# EAGLE schematic Scale_Car_Board_20260624 (EAGLE 9.7.0)
CLIENT: FUTURE MOBILITY LAB; DOCNUM: SC001; REV: 0.0

## Sheet 1 of 4
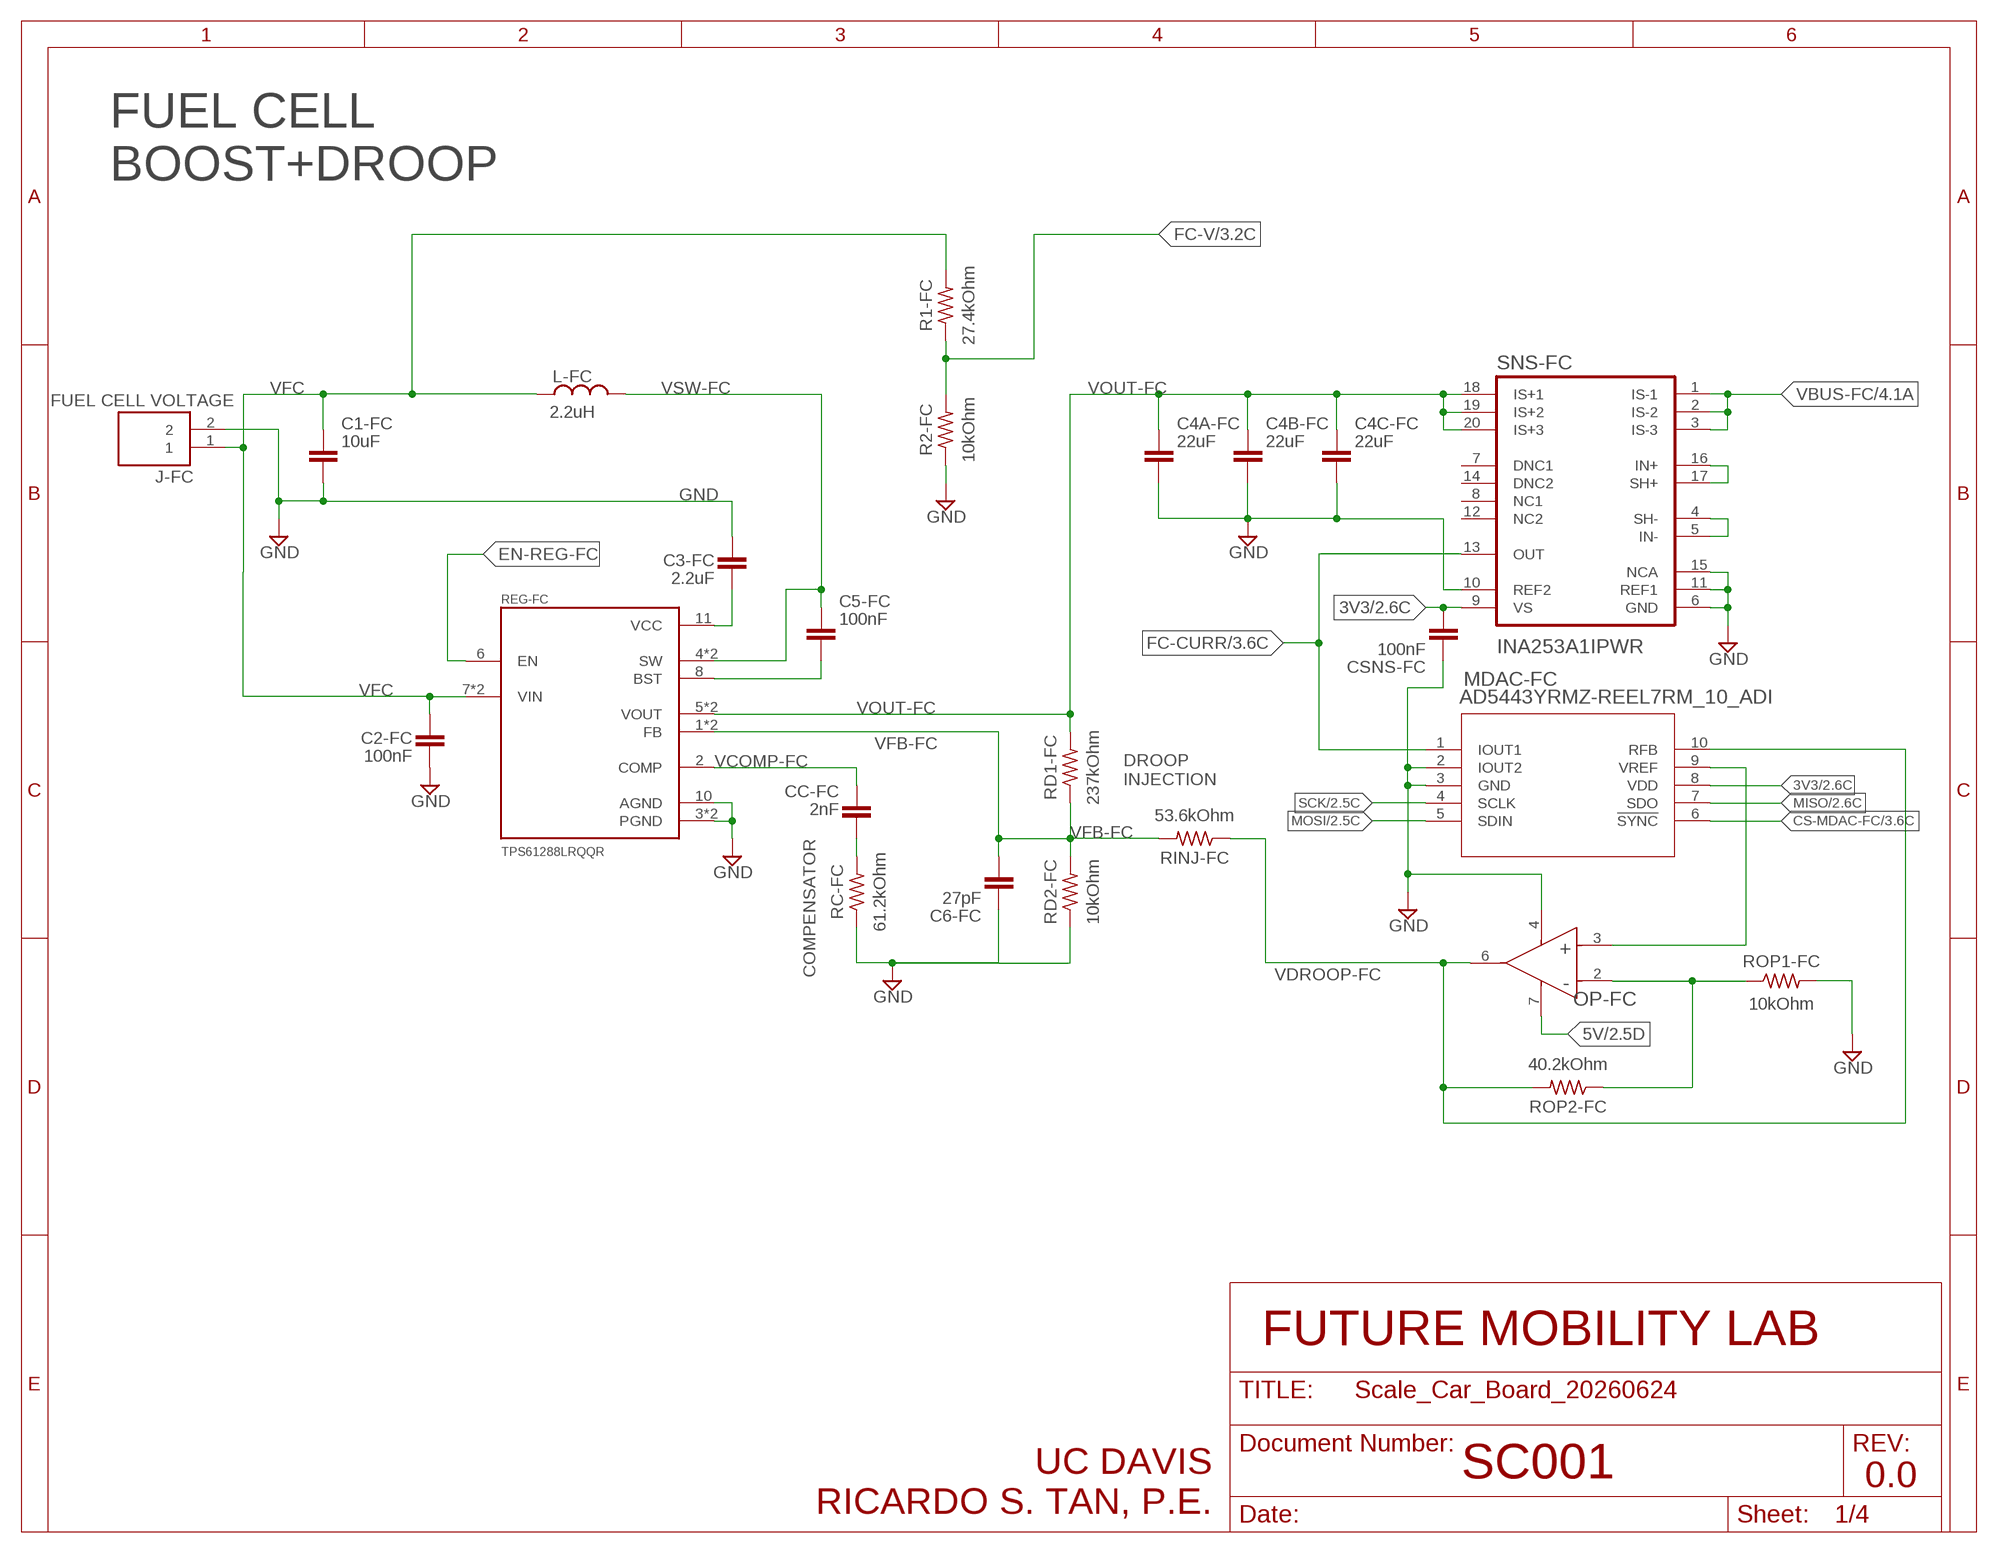
[diagram p0: schematic, sheet 1]

### Parts
C1-FC  10uF  C_CHIP-0805(2012-METRIC)  [CAPC2012X110]
C2-FC  100nF  C_CHIP-0603(1608-METRIC)  [CAPC1608X85]
C3-FC  2.2uF  C_CHIP-0805(2012-METRIC)  [CAPC2012X110]
C4A-FC  22uF  C_CHIP-1210(3225-METRIC)  [CAPC3225X135]
C4B-FC  22uF  C_CHIP-1210(3225-METRIC)  [CAPC3225X135]
C4C-FC  22uF  C_CHIP-1210(3225-METRIC)  [CAPC3225X135]
C5-FC  100nF  C_CHIP-0603(1608-METRIC)  [CAPC1608X85]
C6-FC  27pF  C_CHIP-0603(1608-METRIC)  [CAPC1608X85]
CC-FC  2nF  C_CHIP-0603(1608-METRIC)  [CAPC1608X85]
CSNS-FC  100nF  C_CHIP-0603(1608-METRIC)  [CAPC1608X85]
J-FC  TB005-762-02BE  [CUI_TB005-762-02BE]
L-FC  2.2uH  HCM1A1305V3-2R2-RHCM1A1305V3-2R2-R  [HCM1A1305V3-2R2-R]
MDAC-FC  AD5443YRMZ-REEL7RM_10_ADI  [RM_10_ADI]
OP-FC  OPA197IDD0008A-IPC_A  [D0008A-IPC_A]
R1-FC  27.4kOhm  R-US_CHIP-0603(1608-METRIC)  [RESC1608X60]
R2-FC  10kOhm  R-US_CHIP-0603(1608-METRIC)  [RESC1608X60]
RC-FC  61.2kOhm  R-US_CHIP-0603(1608-METRIC)  [RESC1608X60]
RD1-FC  237kOhm  R-US_CHIP-0603(1608-METRIC)  [RESC1608X60]
RD2-FC  10kOhm  R-US_CHIP-0603(1608-METRIC)  [RESC1608X60]
REG-FC  TPS61288LRQQR  [CONV_TPS61288LRQQR]
RINJ-FC  53.6kOhm  R-US_CHIP-0603(1608-METRIC)  [RESC1608X60]
ROP1-FC  10kOhm  R-US_CHIP-0603(1608-METRIC)  [RESC1608X60]
ROP2-FC  40.2kOhm  R-US_CHIP-0603(1608-METRIC)  [RESC1608X60]
SNS-FC  INA253A1IPWR  [SOP65P640X120-20N]

### Nets
3V3: CSNS-FC.2 MDAC-FC.8(VDD) SNS-FC.9(VS) ; also sheet 2,3
5V: OP-FC.7(V+) ; also sheet 2,3
CS-MDAC-FC: MDAC-FC.6(!SYNC) ; also sheet 3
EN-REG-FC: REG-FC.6(EN) ; also sheet 3
FC-CURR: MDAC-FC.1(IOUT1) SNS-FC.13(OUT) ; also sheet 3
FC-V: R1-FC.1 R2-FC.2 ; also sheet 3
GND: C1-FC.2 C2-FC.2 C3-FC.2 C4A-FC.2 C4B-FC.2 C4C-FC.2 C6-FC.1 CSNS-FC.1 J-FC.2 MDAC-FC.2(IOUT2) MDAC-FC.3(GND) OP-FC.4(V-) R2-FC.1 RC-FC.1 RD2-FC.1 REG-FC.3(PGND) REG-FC.10(AGND) REG-FC.12(PGND) ROP1-FC.2 SNS-FC.6(GND) SNS-FC.10(REF2) SNS-FC.11(REF1) SNS-FC.15(NCA) ; also sheet 2,3,4
MISO: MDAC-FC.7(SDO) ; also sheet 2,3
MOSI: MDAC-FC.5(SDIN) ; also sheet 2,3
N$1: SNS-FC.16(IN+) SNS-FC.17(SH+)
N$2: CC-FC.1 RC-FC.2
N$3: C3-FC.1 REG-FC.11(VCC)
N$4: C5-FC.2 REG-FC.8(BST)
N$5: SNS-FC.4(SH-) SNS-FC.5(IN-)
N$7: MDAC-FC.9(VREF) OP-FC.3(+IN)
N$8: OP-FC.2(-IN) ROP1-FC.1 ROP2-FC.1
SCK: MDAC-FC.4(SCLK) ; also sheet 2,3
VBUS-FC: SNS-FC.1(IS-1) SNS-FC.2(IS-2) SNS-FC.3(IS-3) ; also sheet 4
VCOMP-FC: CC-FC.2 REG-FC.2(COMP)
VDROOP-FC: MDAC-FC.10(RFB) OP-FC.6(OUT) RINJ-FC.1 ROP2-FC.2
VFB-FC: C6-FC.2 RD1-FC.1 RD2-FC.2 REG-FC.1(FB) REG-FC.14(FB) RINJ-FC.2
VFC: C1-FC.1 C2-FC.1 J-FC.1 L-FC.P$1 R1-FC.2 REG-FC.7(VIN) REG-FC.15(VIN)
VOUT-FC: C4A-FC.1 C4B-FC.1 C4C-FC.1 RD1-FC.2 REG-FC.5(VOUT) REG-FC.13(VOUT) SNS-FC.18(IS+1) SNS-FC.19(IS+2) SNS-FC.20(IS+3)
VSW-FC: C5-FC.1 L-FC.P$2 REG-FC.4(SW) REG-FC.9(SW)
Unconnected: SNS-FC.7(DNC1) SNS-FC.8(NC1) SNS-FC.12(NC2) SNS-FC.14(DNC2)

### Notes on the sheet
- FUEL CELL
  BOOST+DROOP
- FUEL CELL VOLTAGE
- DROOP
  INJECTION
- COMPENSATOR
- UC DAVIS
  RICARDO S. TAN, P.E.

## Sheet 2 of 4
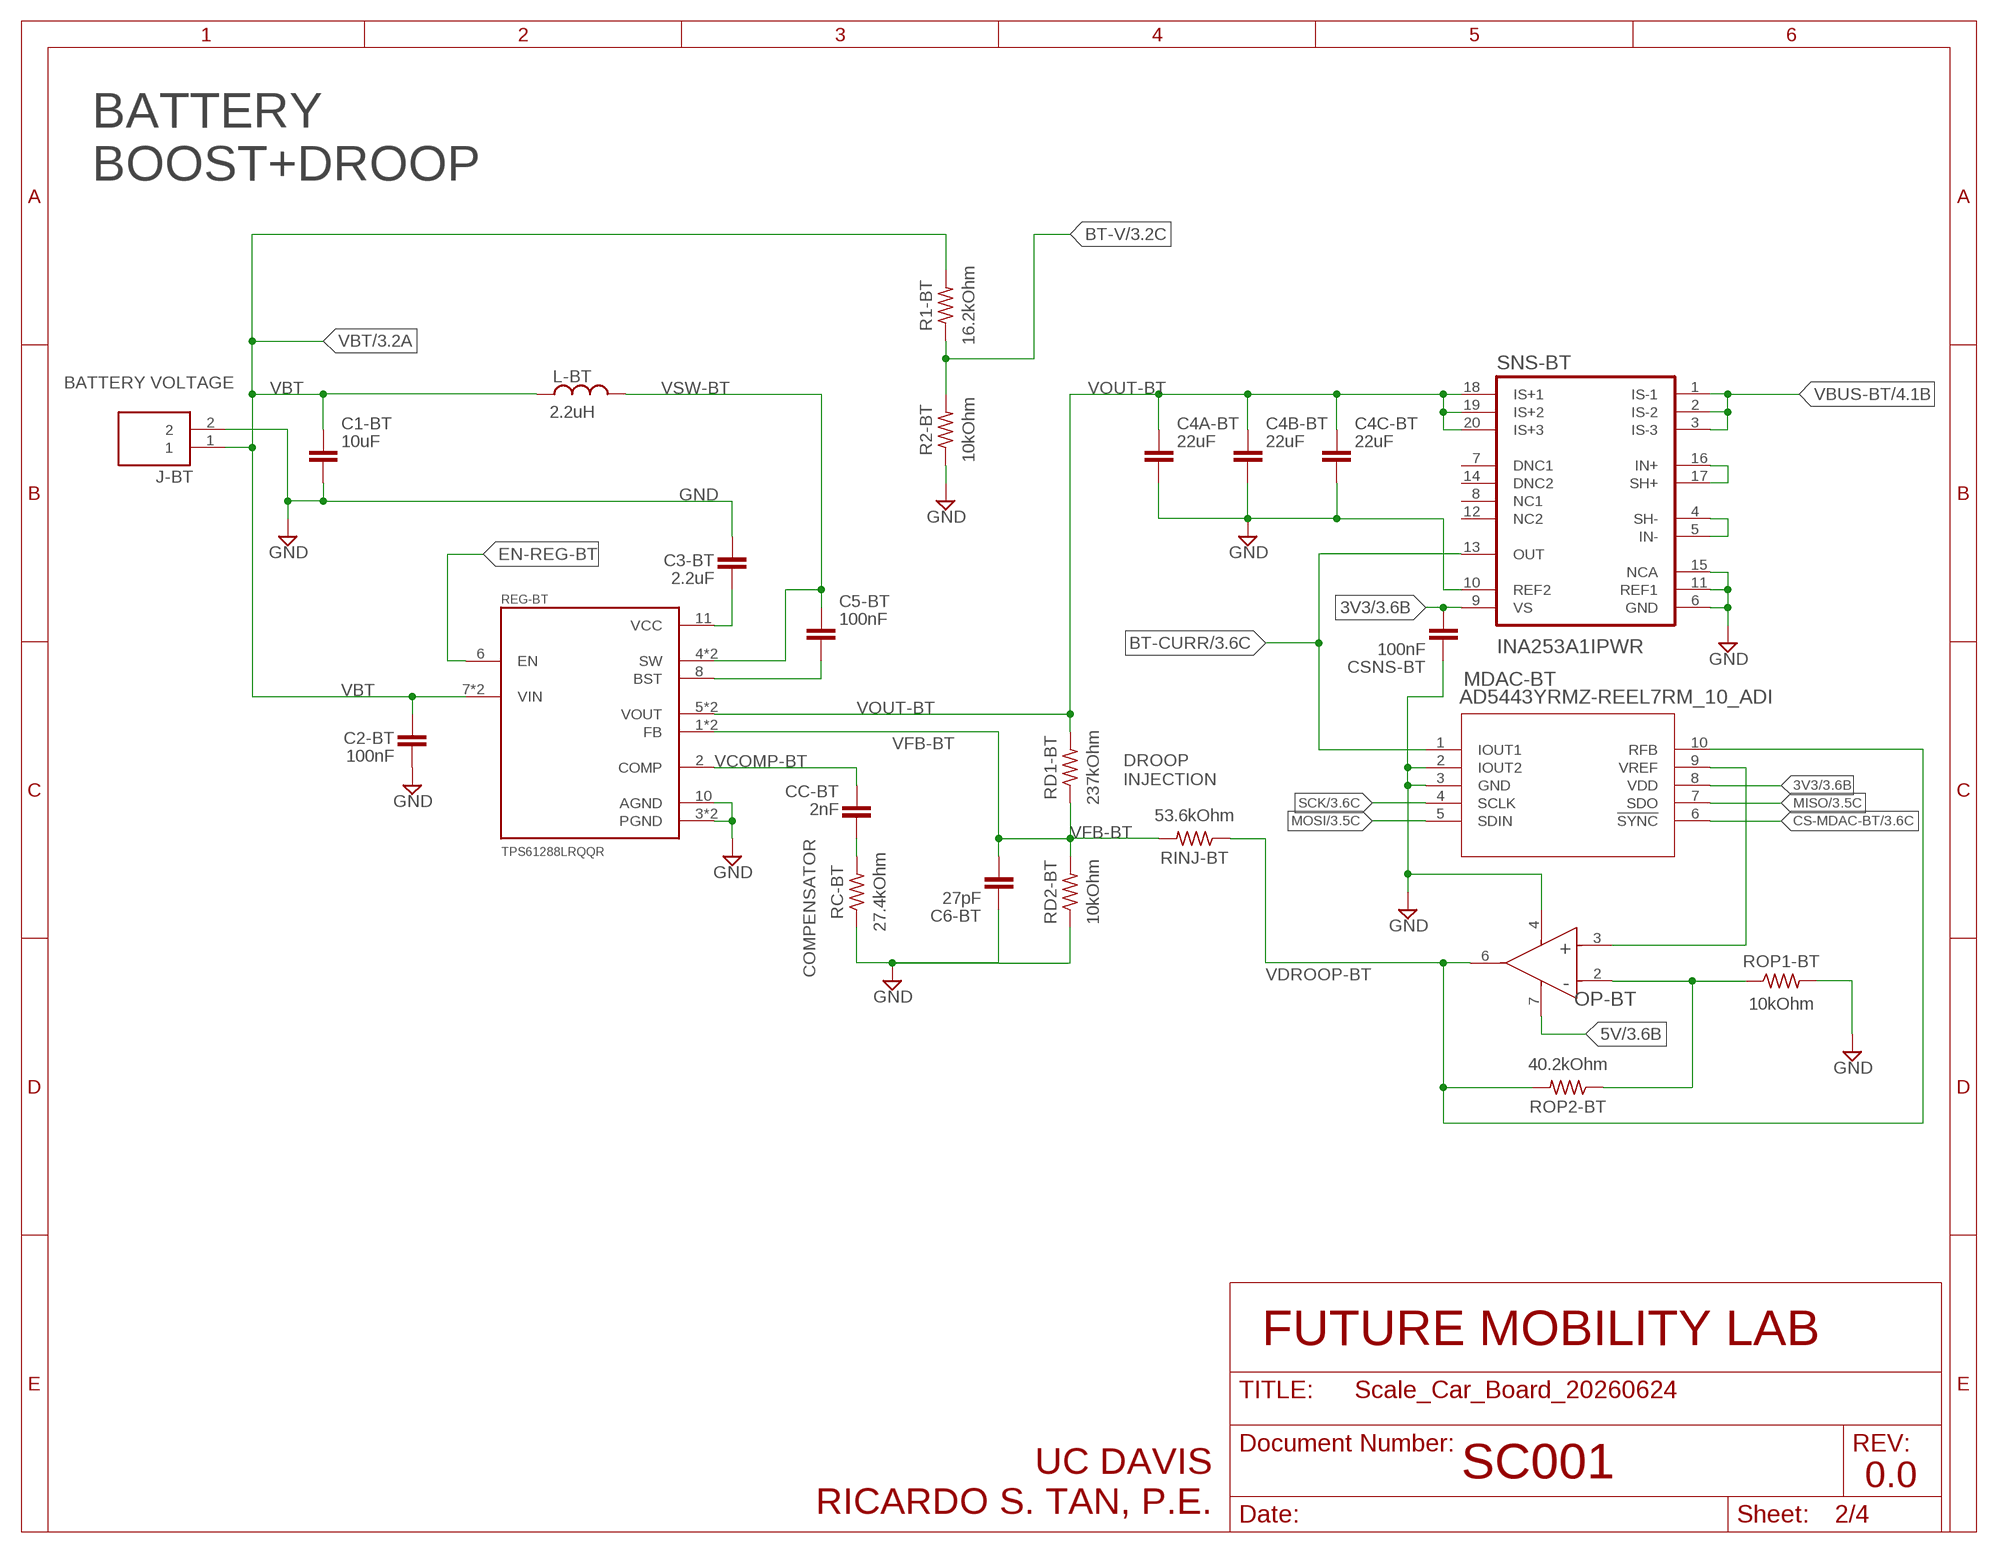
[diagram p1: schematic, sheet 2]

### Parts
C1-BT  10uF  C_CHIP-0805(2012-METRIC)  [CAPC2012X110]
C2-BT  100nF  C_CHIP-0603(1608-METRIC)  [CAPC1608X85]
C3-BT  2.2uF  C_CHIP-0805(2012-METRIC)  [CAPC2012X110]
C4A-BT  22uF  C_CHIP-1210(3225-METRIC)  [CAPC3225X135]
C4B-BT  22uF  C_CHIP-1210(3225-METRIC)  [CAPC3225X135]
C4C-BT  22uF  C_CHIP-1210(3225-METRIC)  [CAPC3225X135]
C5-BT  100nF  C_CHIP-0603(1608-METRIC)  [CAPC1608X85]
C6-BT  27pF  C_CHIP-0603(1608-METRIC)  [CAPC1608X85]
CC-BT  2nF  C_CHIP-0603(1608-METRIC)  [CAPC1608X85]
CSNS-BT  100nF  C_CHIP-0603(1608-METRIC)  [CAPC1608X85]
J-BT  TB005-762-02BE  [CUI_TB005-762-02BE]
L-BT  2.2uH  HCM1A1305V3-2R2-RHCM1A1305V3-2R2-R  [HCM1A1305V3-2R2-R]
MDAC-BT  AD5443YRMZ-REEL7RM_10_ADI  [RM_10_ADI]
OP-BT  OPA197IDD0008A-IPC_A  [D0008A-IPC_A]
R1-BT  16.2kOhm  R-US_CHIP-0603(1608-METRIC)  [RESC1608X60]
R2-BT  10kOhm  R-US_CHIP-0603(1608-METRIC)  [RESC1608X60]
RC-BT  27.4kOhm  R-US_CHIP-0603(1608-METRIC)  [RESC1608X60]
RD1-BT  237kOhm  R-US_CHIP-0603(1608-METRIC)  [RESC1608X60]
RD2-BT  10kOhm  R-US_CHIP-0603(1608-METRIC)  [RESC1608X60]
REG-BT  TPS61288LRQQR  [CONV_TPS61288LRQQR]
RINJ-BT  53.6kOhm  R-US_CHIP-0603(1608-METRIC)  [RESC1608X60]
ROP1-BT  10kOhm  R-US_CHIP-0603(1608-METRIC)  [RESC1608X60]
ROP2-BT  40.2kOhm  R-US_CHIP-0603(1608-METRIC)  [RESC1608X60]
SNS-BT  INA253A1IPWR  [SOP65P640X120-20N]

### Nets
3V3: CSNS-BT.2 MDAC-BT.8(VDD) SNS-BT.9(VS) ; also sheet 1,3
5V: OP-BT.7(V+) ; also sheet 1,3
BT-CURR: MDAC-BT.1(IOUT1) SNS-BT.13(OUT) ; also sheet 3
BT-V: R1-BT.1 R2-BT.2 ; also sheet 3
CS-MDAC-BT: MDAC-BT.6(!SYNC) ; also sheet 3
EN-REG-BT: REG-BT.6(EN) ; also sheet 3
GND: C1-BT.2 C2-BT.2 C3-BT.2 C4A-BT.2 C4B-BT.2 C4C-BT.2 C6-BT.1 CSNS-BT.1 J-BT.2 MDAC-BT.2(IOUT2) MDAC-BT.3(GND) OP-BT.4(V-) R2-BT.1 RC-BT.1 RD2-BT.1 REG-BT.3(PGND) REG-BT.10(AGND) REG-BT.12(PGND) ROP1-BT.2 SNS-BT.6(GND) SNS-BT.10(REF2) SNS-BT.11(REF1) SNS-BT.15(NCA) ; also sheet 1,3,4
MISO: MDAC-BT.7(SDO) ; also sheet 1,3
MOSI: MDAC-BT.5(SDIN) ; also sheet 1,3
N$9: C3-BT.1 REG-BT.11(VCC)
N$10: C5-BT.2 REG-BT.8(BST)
N$11: CC-BT.1 RC-BT.2
N$12: SNS-BT.16(IN+) SNS-BT.17(SH+)
N$13: SNS-BT.4(SH-) SNS-BT.5(IN-)
N$15: MDAC-BT.9(VREF) OP-BT.3(+IN)
N$16: OP-BT.2(-IN) ROP1-BT.1 ROP2-BT.1
SCK: MDAC-BT.4(SCLK) ; also sheet 1,3
VBT: C1-BT.1 C2-BT.1 J-BT.1 L-BT.P$1 R1-BT.2 REG-BT.7(VIN) REG-BT.15(VIN) ; also sheet 3,4
VBUS-BT: SNS-BT.1(IS-1) SNS-BT.2(IS-2) SNS-BT.3(IS-3) ; also sheet 4
VCOMP-BT: CC-BT.2 REG-BT.2(COMP)
VDROOP-BT: MDAC-BT.10(RFB) OP-BT.6(OUT) RINJ-BT.1 ROP2-BT.2
VFB-BT: C6-BT.2 RD1-BT.1 RD2-BT.2 REG-BT.1(FB) REG-BT.14(FB) RINJ-BT.2
VOUT-BT: C4A-BT.1 C4B-BT.1 C4C-BT.1 RD1-BT.2 REG-BT.5(VOUT) REG-BT.13(VOUT) SNS-BT.18(IS+1) SNS-BT.19(IS+2) SNS-BT.20(IS+3)
VSW-BT: C5-BT.1 L-BT.P$2 REG-BT.4(SW) REG-BT.9(SW)
Unconnected: SNS-BT.7(DNC1) SNS-BT.8(NC1) SNS-BT.12(NC2) SNS-BT.14(DNC2)

### Notes on the sheet
- BATTERY
  BOOST+DROOP
- BATTERY VOLTAGE
- DROOP
  INJECTION
- COMPENSATOR
- UC DAVIS
  RICARDO S. TAN, P.E.

## Sheet 3 of 4
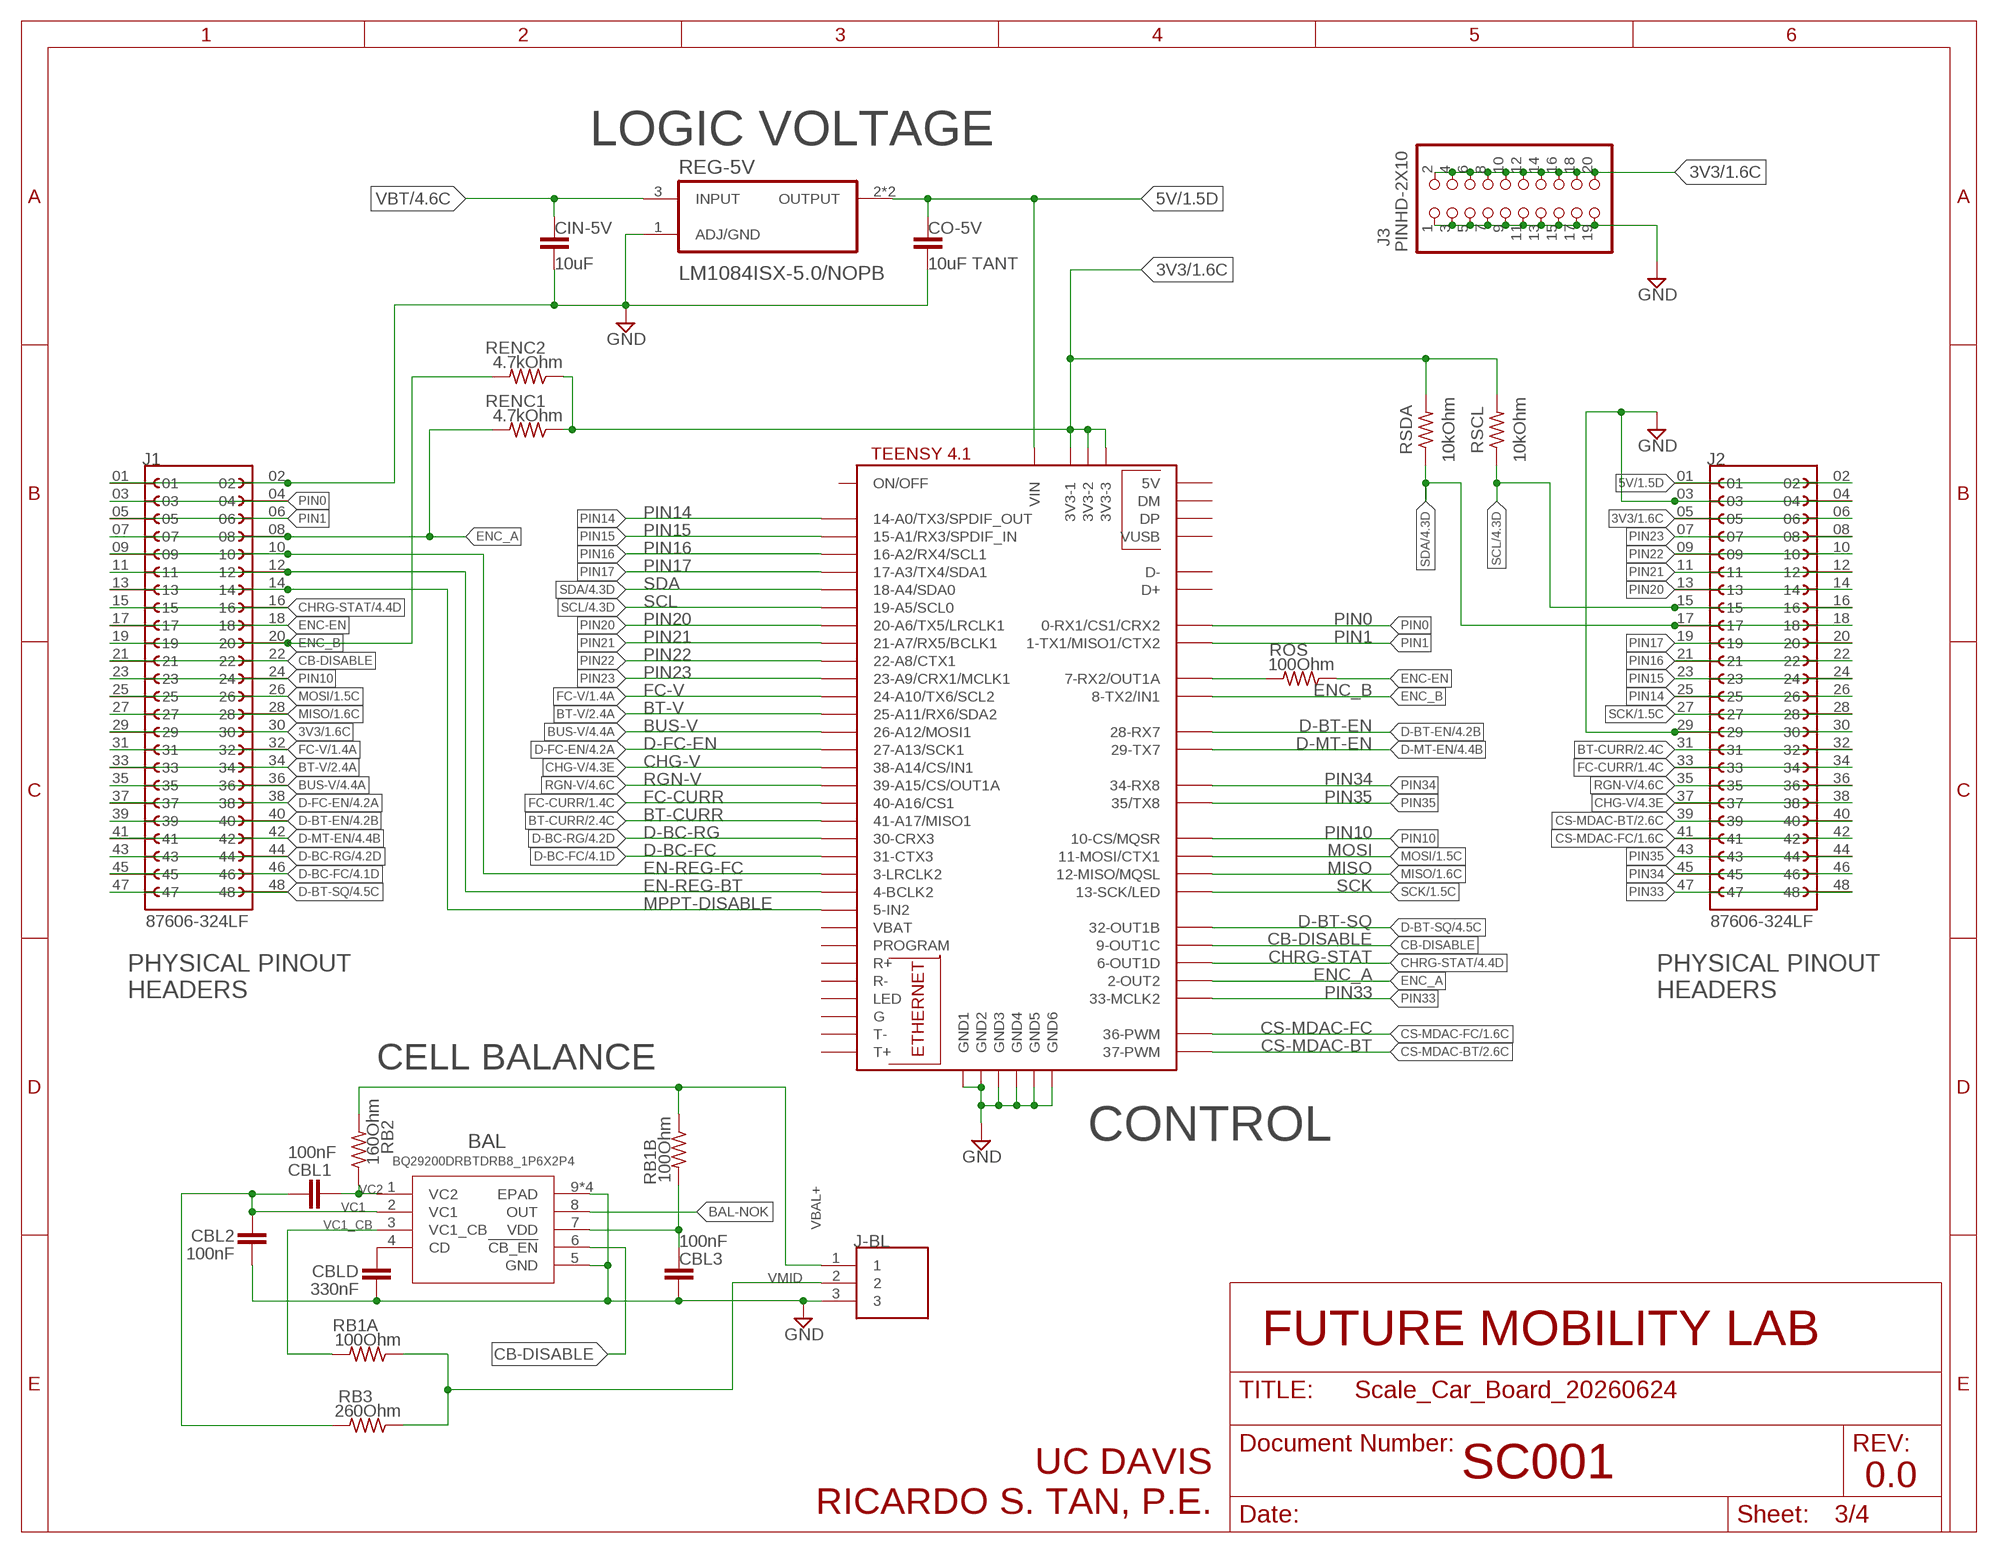
[diagram p2: schematic, sheet 3]

### Parts
BAL  BQ29200DRBTDRB8_1P6X2P4  [DRB8_1P6X2P4]
CBL1  100nF  C_CHIP-0603(1608-METRIC)  [CAPC1608X85]
CBL2  100nF  C_CHIP-0603(1608-METRIC)  [CAPC1608X85]
CBL3  100nF  C_CHIP-0603(1608-METRIC)  [CAPC1608X85]
CBLD  330nF  C_CHIP-0603(1608-METRIC)  [CAPC1608X85]
CIN-5V  10uF  C_CHIP-0805(2012-METRIC)  [CAPC2012X110]
CO-5V  10uF TANT  C_TANTALUM-1411(3528-METRIC)  [CAPM3528X210]
J1  87606-324LF  [AMPHENOL_87606-324LF]
J2  87606-324LF  [AMPHENOL_87606-324LF]
J3  PINHD-2X10  [2X10]
J-BL  TB005_762_03BE  [CUI_TB005_-762-03BE]
RB1A  100Ohm  R-US_CHIP-0402(1005-METRIC)  [RESC1005X40]
RB1B  100Ohm  R-US_CHIP-0402(1005-METRIC)  [RESC1005X40]
RB2  160Ohm  R-US_CHIP-0402(1005-METRIC)  [RESC1005X40]
RB3  260Ohm  R-US_CHIP-0402(1005-METRIC)  [RESC1005X40]
REG-5V  LM1084ISX-5.0/NOPB  [TO254P1524X483-4N]
RENC1  4.7kOhm  R-US_CHIP-0603(1608-METRIC)  [RESC1608X60]
RENC2  4.7kOhm  R-US_CHIP-0603(1608-METRIC)  [RESC1608X60]
ROS  100Ohm  R-US_CHIP-0603(1608-METRIC)  [RESC1608X60]
RSCL  10kOhm  R-US_CHIP-0603(1608-METRIC)  [RESC1608X60]
RSDA  10kOhm  R-US_CHIP-0603(1608-METRIC)  [RESC1608X60]
U$1  TEENSY41  [TEENSY41]

### Nets
3V3: J1.29 J1.30 J2.05 J2.06 J3.2 J3.4 J3.6 J3.8 J3.10 J3.12 J3.14 J3.16 J3.18 J3.20 RENC1.1 RENC2.1 RSCL.2 RSDA.2 U$1.3V3-1 U$1.3V3-2 U$1.3V3-3 ; also sheet 1,2
5V: CO-5V.1 J2.01 J2.02 REG-5V.2(OUTPUT) REG-5V.4(OUTPUT) U$1.VIN ; also sheet 1,2
BAL-NOK: BAL.8(OUT)
BT-CURR: J2.31 J2.32 U$1.41-A17/MISO1 ; also sheet 2
BT-V: J1.33 J1.34 U$1.25-A11/RX6/SDA2 ; also sheet 2
BUS-V: J1.35 J1.36 U$1.26-A12/MOSI1 ; also sheet 4
CB-DISABLE: BAL.6(!CB_EN) J1.21 J1.22 U$1.9-OUT1C
CHG-V: J2.37 J2.38 U$1.38-A14/CS/IN1 ; also sheet 4
CHRG-STAT: J1.15 J1.16 U$1.6-OUT1D ; also sheet 4
CS-MDAC-BT: J2.39 J2.40 U$1.37-PWM ; also sheet 2
CS-MDAC-FC: J2.41 J2.42 U$1.36-PWM ; also sheet 1
D-BC-FC: J1.45 J1.46 U$1.31-CTX3 ; also sheet 4
D-BC-RG: J1.43 J1.44 U$1.30-CRX3 ; also sheet 4
D-BT-EN: J1.39 J1.40 U$1.28-RX7 ; also sheet 4
D-BT-SQ: J1.47 J1.48 U$1.32-OUT1B ; also sheet 4
D-FC-EN: J1.37 J1.38 U$1.27-A13/SCK1 ; also sheet 4
D-MT-EN: J1.41 J1.42 U$1.29-TX7 ; also sheet 4
EN-REG-BT: J1.11 J1.12 U$1.4-BCLK2 ; also sheet 2
EN-REG-FC: J1.09 J1.10 U$1.3-LRCLK2 ; also sheet 1
ENC-EN: J1.17 J1.18 ROS.1
ENC_A: J1.07 J1.08 RENC1.2 U$1.2-OUT2
ENC_B: J1.19 J1.20 RENC2.2 U$1.8-TX2/IN1
FC-CURR: J2.33 J2.34 U$1.40-A16/CS1 ; also sheet 1
FC-V: J1.31 J1.32 U$1.24-A10/TX6/SCL2 ; also sheet 1
GND: BAL.5(GND) BAL.9(EPAD) BAL.V(EPAD) BAL.V_2(EPAD) BAL.V_4(EPAD) CBL2.2 CBL3.2 CBLD.2 CIN-5V.2 CO-5V.2 J1.01 J1.02 J2.03 J2.04 J2.29 J2.30 J3.1 J3.3 J3.5 J3.7 J3.9 J3.11 J3.13 J3.15 J3.17 J3.19 J-BL.3 REG-5V.1(ADJ/GND) U$1.GND1 U$1.GND2 U$1.GND3 U$1.GND4 U$1.GND5 U$1.GND6 ; also sheet 1,2,4
MISO: J1.27 J1.28 U$1.12-MISO/MQSL ; also sheet 1,2
MOSI: J1.25 J1.26 U$1.11-MOSI/CTX1 ; also sheet 1,2
MPPT-DISABLE: J1.13 J1.14 U$1.5-IN2 ; also sheet 4
N$21: ROS.2 U$1.7-RX2/OUT1A
N$35: BAL.4(CD) CBLD.1
N$38: BAL.7(VDD) CBL3.1 RB1B.2
PIN0: J1.03 J1.04 U$1.0-RX1/CS1/CRX2
PIN1: J1.05 J1.06 U$1.1-TX1/MISO1/CTX2
PIN10: J1.23 J1.24 U$1.10-CS\MQSR(10-CS/MQSR)
PIN14: J2.25 J2.26 U$1.14-A0/TX3/SPDIF_OUT
PIN15: J2.23 J2.24 U$1.15-A1/RX3/SPDIF_IN
PIN16: J2.21 J2.22 U$1.16-A2/RX4/SCL1
PIN17: J2.19 J2.20 U$1.17-A3/TX4/SDA1
PIN20: J2.13 J2.14 U$1.20-A6/TX5/LRCLK1
PIN21: J2.11 J2.12 U$1.21-A7/RX5/BCLK1
PIN22: J2.09 J2.10 U$1.22-A8/CTX1
PIN23: J2.07 J2.08 U$1.23-A9/CRX1/MCLK1
PIN33: J2.47 J2.48 U$1.33-MCLK2
PIN34: J2.45 J2.46 U$1.34-RX8
PIN35: J2.43 J2.44 U$1.35-TX8(35/TX8)
RGN-V: J2.35 J2.36 U$1.39-A15/CS/OUT1A ; also sheet 4
SCK: J2.27 J2.28 U$1.13-SCK/LED ; also sheet 1,2
SCL: J2.15 J2.16 RSCL.1 U$1.19-A5/SCL0 ; also sheet 4
SDA: J2.17 J2.18 RSDA.1 U$1.18-A4/SDA0 ; also sheet 4
VBAL+: J-BL.1 RB1B.1 RB2.2
VBT: CIN-5V.1 REG-5V.3(INPUT) ; also sheet 2,4
VC1: BAL.2(VC1) CBL1.1 CBL2.1 RB3.2
VC1_CB: BAL.3(VC1_CB) RB1A.2
VC2: BAL.1(VC2) CBL1.2 RB2.1
VMID: J-BL.2 RB1A.1 RB3.1
Unconnected: U$1.+5V(5V) U$1.D+ U$1.D- U$1.DM U$1.DP U$1.G U$1.LED U$1.ON/OFF U$1.PROGRAM U$1.R+ U$1.R- U$1.T+ U$1.T- U$1.VBAT U$1.VUSB

### Notes on the sheet
- LOGIC VOLTAGE
- PHYSICAL PINOUT
  HEADERS
- PHYSICAL PINOUT
  HEADERS
- CELL BALANCE
- CONTROL
- UC DAVIS
  RICARDO S. TAN, P.E.

## Sheet 4 of 4
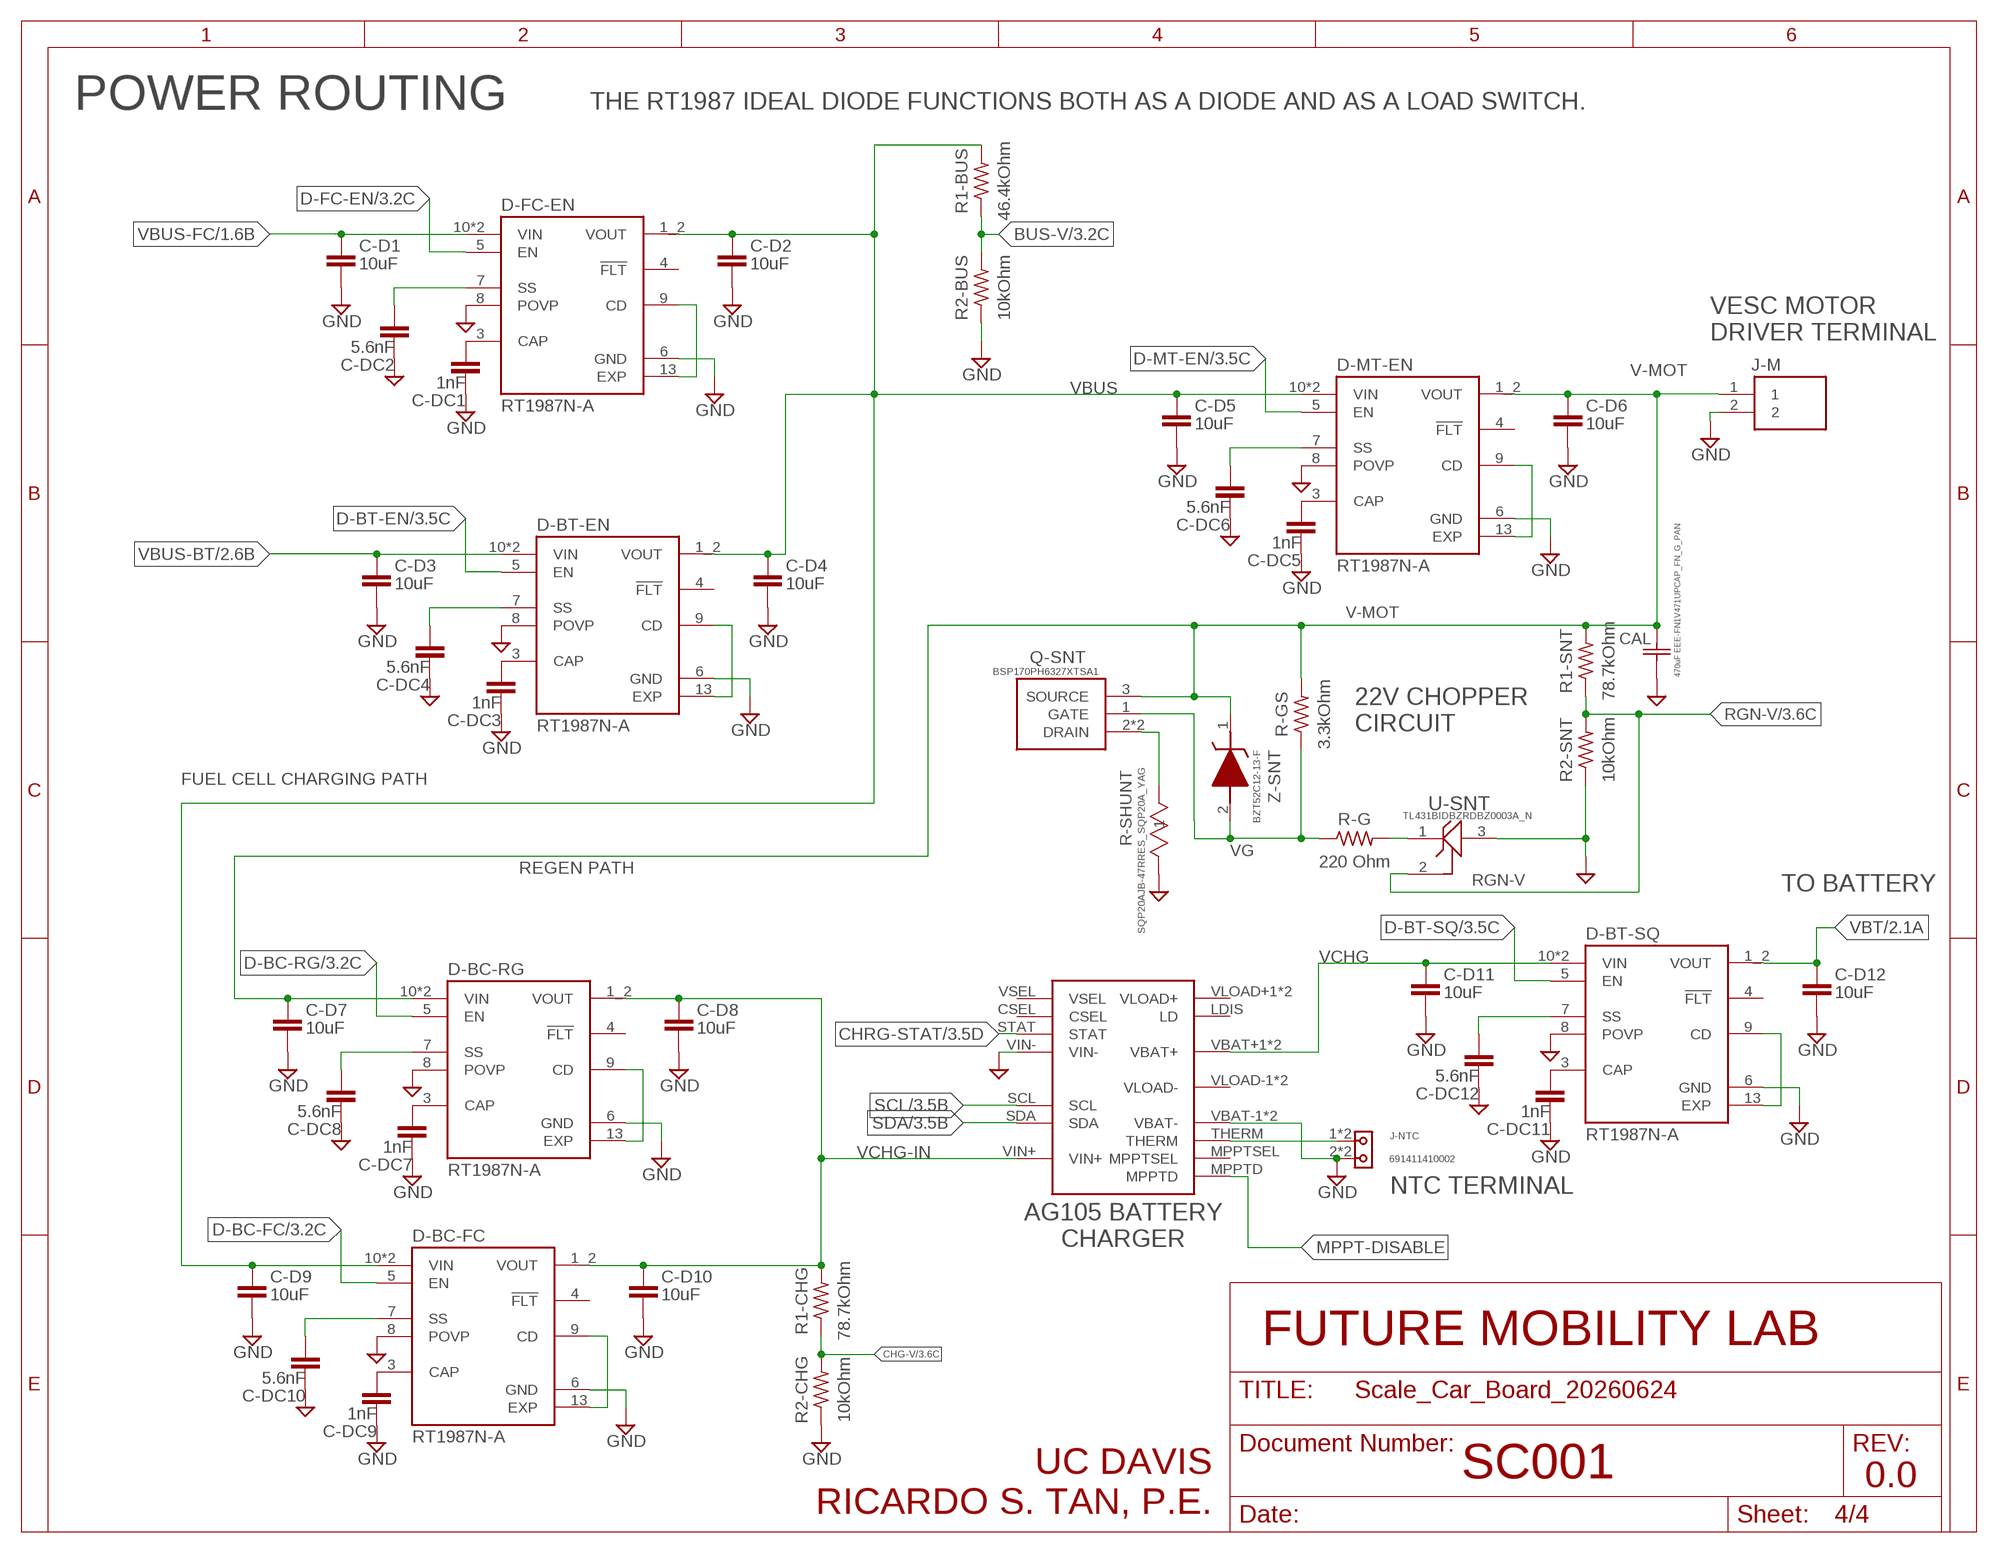
[diagram p3: schematic, sheet 4]

### Parts
C-D1  10uF  C_CHIP-0805(2012-METRIC)  [CAPC2012X110]
C-D2  10uF  C_CHIP-0805(2012-METRIC)  [CAPC2012X110]
C-D3  10uF  C_CHIP-0805(2012-METRIC)  [CAPC2012X110]
C-D4  10uF  C_CHIP-0805(2012-METRIC)  [CAPC2012X110]
C-D5  10uF  C_CHIP-0805(2012-METRIC)  [CAPC2012X110]
C-D6  10uF  C_CHIP-1206(3216-METRIC)  [CAPC3216X135]
C-D7  10uF  C_CHIP-1206(3216-METRIC)  [CAPC3216X135]
C-D8  10uF  C_CHIP-0805(2012-METRIC)  [CAPC2012X110]
C-D9  10uF  C_CHIP-1206(3216-METRIC)  [CAPC3216X135]
C-D10  10uF  C_CHIP-0805(2012-METRIC)  [CAPC2012X110]
C-D11  10uF  C_CHIP-0805(2012-METRIC)  [CAPC2012X110]
C-D12  10uF  C_CHIP-0805(2012-METRIC)  [CAPC2012X110]
C-DC1  1nF  C_CHIP-0402(1005-METRIC)  [CAPC1005X60]
C-DC2  5.6nF  C_CHIP-0402(1005-METRIC)  [CAPC1005X60]
C-DC3  1nF  C_CHIP-0402(1005-METRIC)  [CAPC1005X60]
C-DC4  5.6nF  C_CHIP-0402(1005-METRIC)  [CAPC1005X60]
C-DC5  1nF  C_CHIP-0402(1005-METRIC)  [CAPC1005X60]
C-DC6  5.6nF  C_CHIP-0402(1005-METRIC)  [CAPC1005X60]
C-DC7  1nF  C_CHIP-0402(1005-METRIC)  [CAPC1005X60]
C-DC8  5.6nF  C_CHIP-0402(1005-METRIC)  [CAPC1005X60]
C-DC9  1nF  C_CHIP-0402(1005-METRIC)  [CAPC1005X60]
C-DC10  5.6nF  C_CHIP-0402(1005-METRIC)  [CAPC1005X60]
C-DC11  1nF  C_CHIP-0402(1005-METRIC)  [CAPC1005X60]
C-DC12  5.6nF  C_CHIP-0402(1005-METRIC)  [CAPC1005X60]
CAL  470uF EEE-FN1V471UPCAP_FN_G_PAN  EEE-FN1V471UPCAP_FN_G_PAN  [CAP_FN_G_PAN]
CHG  AG105  [AG105]
D-BC-FC  RT1987N-A  [IC_RT1987N-A]
D-BC-RG  RT1987N-A  [IC_RT1987N-A]
D-BT-EN  RT1987N-A  [IC_RT1987N-A]
D-BT-SQ  RT1987N-A  [IC_RT1987N-A]
D-FC-EN  RT1987N-A  [IC_RT1987N-A]
D-MT-EN  RT1987N-A  [IC_RT1987N-A]
J-M  TB005-762-02BE  [CUI_TB005-762-02BE]
J-NTC  691411410002  [691411410002]
Q-SNT  BSP170PH6327XTSA1  [SOT230P700X170-4N]
R1-BUS  46.4kOhm  R-US_CHIP-0603(1608-METRIC)  [RESC1608X60]
R1-CHG  78.7kOhm  R-US_CHIP-0402(1005-METRIC)  [RESC1005X40]
R1-SNT  78.7kOhm  R-US_CHIP-0402(1005-METRIC)  [RESC1005X40]
R2-BUS  10kOhm  R-US_CHIP-0603(1608-METRIC)  [RESC1608X60]
R2-CHG  10kOhm  R-US_CHIP-0603(1608-METRIC)  [RESC1608X60]
R2-SNT  10kOhm  R-US_CHIP-0603(1608-METRIC)  [RESC1608X60]
R-G  220 Ohm  R-US_CHIP-0402(1005-METRIC)  [RESC1005X40]
R-GS  3.3kOhm  R-US_CHIP-0603(1608-METRIC)  [RESC1608X60]
R-SHUNT  SQP20AJB-47RRES_SQP20A_YAG  [RES_SQP20A_YAG]
U-SNT  TL431BIDBZRDBZ0003A_N  [DBZ0003A_N]
Z-SNT  BZT52C12-13-F  [SOD3716X145N]

### Nets
BUS-V: R1-BUS.1 R2-BUS.2 ; also sheet 3
CHG-V: R1-CHG.1 R2-CHG.2 ; also sheet 3
CHRG-STAT: CHG.STAT ; also sheet 3
D-BC-FC: D-BC-FC.5(EN) ; also sheet 3
D-BC-RG: D-BC-RG.5(EN) ; also sheet 3
D-BT-EN: D-BT-EN.5(EN) ; also sheet 3
D-BT-SQ: D-BT-SQ.5(EN) ; also sheet 3
D-FC-EN: D-FC-EN.5(EN) ; also sheet 3
D-MT-EN: D-MT-EN.5(EN) ; also sheet 3
GND: C-D1.2 C-D2.2 C-D3.2 C-D4.2 C-D5.2 C-D6.2 C-D7.2 C-D8.2 C-D9.2 C-D10.2 C-D11.2 C-D12.2 C-DC1.1 C-DC2.1 C-DC3.1 C-DC4.1 C-DC5.1 C-DC6.1 C-DC7.1 C-DC8.1 C-DC9.1 C-DC10.1 C-DC11.1 C-DC12.1 CAL.2 CHG.VBAT-1(VBAT-) CHG.VBAT-2(VBAT-) CHG.VIN- D-BC-FC.6(GND) D-BC-FC.8(POVP) D-BC-RG.6(GND) D-BC-RG.8(POVP) D-BT-EN.6(GND) D-BT-EN.8(POVP) D-BT-SQ.6(GND) D-BT-SQ.8(POVP) D-FC-EN.6(GND) D-FC-EN.8(POVP) D-MT-EN.6(GND) D-MT-EN.8(POVP) J-M.2 J-NTC.2 J-NTC.A2 R2-BUS.1 R2-CHG.1 R2-SNT.1 R-SHUNT.2 U-SNT.3(ANODE) ; also sheet 1,2,3
MPPT-DISABLE: CHG.MPPTD ; also sheet 3
N$6: C-DC1.2 D-FC-EN.3(CAP)
N$14: C-DC3.2 D-BT-EN.3(CAP)
N$17: D-FC-EN.9(CD) D-FC-EN.13(EXP)
N$18: C-DC2.2 D-FC-EN.7(SS)
N$19: D-BT-EN.9(CD) D-BT-EN.13(EXP)
N$20: C-DC4.2 D-BT-EN.7(SS)
N$22: C-DC5.2 D-MT-EN.3(CAP)
N$23: C-DC7.2 D-BC-RG.3(CAP)
N$24: D-MT-EN.9(CD) D-MT-EN.13(EXP)
N$25: C-DC6.2 D-MT-EN.7(SS)
N$26: D-BC-RG.9(CD) D-BC-RG.13(EXP)
N$27: C-DC8.2 D-BC-RG.7(SS)
N$28: C-DC9.2 D-BC-FC.3(CAP)
N$29: D-BC-FC.9(CD) D-BC-FC.13(EXP)
N$30: C-DC10.2 D-BC-FC.7(SS)
N$31: C-DC11.2 D-BT-SQ.3(CAP)
N$32: D-BT-SQ.9(CD) D-BT-SQ.13(EXP)
N$33: C-DC12.2 D-BT-SQ.7(SS)
N$34: CHG.THERM J-NTC.1 J-NTC.A1
N$36: R-G.2 U-SNT.1(CATHODE)
N$39: Q-SNT.2(DRAIN) Q-SNT.4(DRAIN) R-SHUNT.1
RGN-V: R1-SNT.1 R2-SNT.2 U-SNT.2(REF) ; also sheet 3
SCL: CHG.SCL ; also sheet 3
SDA: CHG.SDA ; also sheet 3
V-MOT: C-D6.1 C-D7.1 CAL.1 D-BC-RG.10(VIN) D-BC-RG.11_12(VIN) D-MT-EN.1_2(VOUT) J-M.1 Q-SNT.3(SOURCE) R1-SNT.2 R-GS.2 Z-SNT.1(K)
VBT: C-D12.1 D-BT-SQ.1_2(VOUT) ; also sheet 2,3
VBUS: C-D2.1 C-D4.1 C-D5.1 C-D9.1 D-BC-FC.10(VIN) D-BC-FC.11_12(VIN) D-BT-EN.1_2(VOUT) D-FC-EN.1_2(VOUT) D-MT-EN.10(VIN) D-MT-EN.11_12(VIN) R1-BUS.2
VBUS-BT: C-D3.1 D-BT-EN.10(VIN) D-BT-EN.11_12(VIN) ; also sheet 2
VBUS-FC: C-D1.1 D-FC-EN.10(VIN) D-FC-EN.11_12(VIN) ; also sheet 1
VCHG: C-D11.1 CHG.VBAT+1(VBAT+) CHG.VBAT+2(VBAT+) D-BT-SQ.10(VIN) D-BT-SQ.11_12(VIN)
VCHG-IN: C-D8.1 C-D10.1 CHG.VIN+ D-BC-FC.1_2(VOUT) D-BC-RG.1_2(VOUT) R1-CHG.2
VG: Q-SNT.1(GATE) R-G.1 R-GS.1 Z-SNT.2(A)
Unconnected: CHG.CSEL CHG.LDIS(LD) CHG.MPPTSEL CHG.VLOAD+1(VLOAD+) CHG.VLOAD+2(VLOAD+) CHG.VLOAD-1(VLOAD-) CHG.VLOAD-2(VLOAD-) CHG.VSEL D-BC-FC.4(!FLT) D-BC-RG.4(!FLT) D-BT-EN.4(!FLT) D-BT-SQ.4(!FLT) D-FC-EN.4(!FLT) D-MT-EN.4(!FLT)

### Notes on the sheet
- POWER ROUTING | THE RT1987 IDEAL DIODE FUNCTIONS BOTH AS A DIODE AND AS A LOAD SWITCH.
- VESC MOTOR 
  DRIVER TERMINAL
- 22V CHOPPER
  CIRCUIT
- FUEL CELL CHARGING PATH
- REGEN PATH
- TO BATTERY
- NTC TERMINAL
- AG105 BATTERY
  CHARGER
- UC DAVIS
  RICARDO S. TAN, P.E.

## Library data of the parts
BAL = BQ29200DRBT:BQ29200DRBT; COPYRIGHT: Copyright (C) 2026 Ultra Librarian. All rights reserved.; DATASHEET: https://www.ti.com/lit/gpn/bq29200; DESCRIPTION: Voltage Protection with Automatic Cell Balance For 2-Cell Li-Ion Batteries, OVP=4.35V 8-SON -40 to 85; MANUFACTURER_NAME: Texas Instruments; MANUFACTURER_PART_NUMBER: BQ29200DRBT
C1-BT C1-FC C2-BT C2-FC C3-BT C3-FC C4A-BT C4A-FC C4B-BT C4B-FC C4C-BT C4C-FC C5-BT C5-FC C6-BT C6-FC C-D1-C-D12 C-DC1-C-DC12 CBL1-CBL3 CBLD CC-BT CC-FC CIN-5V CO-5V CSNS-BT CSNS-FC = Tutorial - Fusion 360:C: Capacitor - Generic; CATEGORY: Capacitor
CAL = EEE_FN1V471UP:EEE-FN1V471UP; COPYRIGHT: Copyright (C) 2026 Ultra Librarian. All rights reserved.; MANUFACTURER_NAME: Panasonic; MANUFACTURER_PART_NUMBER: EEE-FN1V471UP
CHG = Silvertel Ag105:AG105
D-BC-FC D-BC-RG D-BT-EN D-BT-SQ D-FC-EN D-MT-EN = RT1987N-A:RT1987N-A: Check availability <https://pricing.snapeda.com/parts/RT1987N-A/Richtek%20USA%20Inc./view-part?ref=eda>; AVAILABILITY: In Stock; CHECK_PRICES: https://www.snapeda.com/parts/RT1987N-A/Richtek/view-part/?ref=eda; DESCRIPTION: OR Controller N+1 ORing Controller N-Channel 1:1 12-VDFN Type V (3x3); MF: Richtek USA Inc.; MP: RT1987N-A; PACKAGE: None; PRICE: None; SNAPEDA_LINK: https://www.snapeda.com/parts/RT1987N-A/Richtek/view-part/?ref=snap
J1 J2 = 87606-324LF:87606-324LF; MANUFACTURER: Amphenol ICC (FCI); PARTREV: S; STANDARD: Manufacturer Recommendations
J3 = Connector:PINHD-2X10: PIN HEADER; CATEGORY: Headers; DESCRIPTION: Header, Straight, 2x10 Position; MANUFACTURER: Generic; MPN: Generic; OPERATING_TEMPERATURE: Generic; PART_STATUS: Active; PITCH: 0.100" (2.54mm); ROHS_COMPLIANCE: Generic; SERIES: Generic; SUB-CATEGORY: Headers, Male Pins; TYPE: Board to Board or Cable, Unshrouded, Through Hole, Straight
J-BL = TB005 -762-03BE:TB005_762_03BE
J-BT J-FC J-M = TB005-762-02BE:TB005-762-02BE; MANUFACTURER: CUI; STANDARD: Manufacturer Recommendations
J-NTC = Wurth 691411410002:691411410002
L-BT L-FC = HCM1A1305V3-2R2-R:HCM1A1305V3-2R2-R
MDAC-BT MDAC-FC = AD5443YRMZ_REEL7:AD5443YRMZ-REEL7; COPYRIGHT: Copyright (C) 2026 Ultra Librarian. All rights reserved.; DATASHEET: https://www.analog.com/media/en/technical-documentation/data-sheets/AD5426_5432_5443.pdf; DESCRIPTION: 12-Bit High Bandwidth Multiplying DAC's with Serial Interface; MANUFACTURER_NAME: Analog Devices Inc; MANUFACTURER_PART_NUMBER: AD5443YRMZ-REEL7
OP-BT OP-FC = OPA197:OPA197ID; COPYRIGHT: Copyright (C) 2026 Ultra Librarian. All rights reserved.; DATASHEET: https://www.ti.com/lit/gpn/opa197; DESCRIPTION: Single, 36-V, precision, rail-to-rail input output, low offset voltage op amp 8-SOIC -40 to 125; MANUFACTURER_NAME: Texas Instruments; MANUFACTURER_PART_NUMBER: OPA197ID; REFDES: RefDes; TYPE: TYPE
Q-SNT = BSP170PH6327XTSA1:BSP170PH6327XTSA1: MOSFET P-Ch -60V -1.9A SOT-223-3 Source: Datasheet; DESCRIPTION: MOSFET P-Ch -60V -1.9A SOT-223-3; HEIGHT: 1.7mm; MANUFACTURER_NAME: Infineon; MANUFACTURER_PART_NUMBER: BSP170PH6327XTSA1; MOUSER_PART_NUMBER: 726-BSP170PH6327XTSA; MOUSER_PRICE-STOCK: https://www.mouser.co.uk/ProductDetail/Infineon-Technologies/BSP170PH6327XTSA1?qs=LqwxS8kK3AuKjNiJohPfXg%3D%3D
R1-BT R1-BUS R1-CHG R1-FC R1-SNT R2-BT R2-BUS R2-CHG R2-FC R2-SNT R-G R-GS RB1A RB1B RB2 RB3 RC-BT RC-FC RD1-BT RD1-FC RD2-BT RD2-FC RENC1 RENC2 RINJ-BT RINJ-FC ROP1-BT ROP1-FC ROP2-BT ROP2-FC ROS RSCL RSDA = Resistor:R-US: Resistor Fixed - ANSI; CATEGORY: Resistor; SUB-CATEGORY: Fixed
R-SHUNT = SQP20AJB_47R:SQP20AJB-47R; COPYRIGHT: Copyright (C) 2026 Ultra Librarian. All rights reserved.; MANUFACTURER_NAME: Yageo; MANUFACTURER_PART_NUMBER: SQP20AJB-47R
REG-5V = LM1084ISX-5:LM1084ISX-5.0/NOPB
REG-BT REG-FC = TPS61288LRQQR:TPS61288LRQQR; MANUFACTURER: Texas Instruments; MAXIMUM_PACKAGE_HEIGHT: 1 mm; PARTREV: C; SNAPEDA_PACKAGE_ID: 121210; STANDARD: Manufacturer Recommendations
SNS-BT SNS-FC = INA253A1IPWR:INA253A1IPWR
U$1 = TEENSY:TEENSY41
U-SNT = TL431BIDBZR:TL431BIDBZR; COPYRIGHT: Copyright (C) 2026 Ultra Librarian. All rights reserved.; DATASHEET: https://www.ti.com/lit/gpn/tl431; DESCRIPTION: Adjustable precision shunt regulator 3-SOT-23 -40 to 85; MANUFACTURER_NAME: Texas Instruments; MANUFACTURER_PART_NUMBER: TL431BIDBZR; REFDES: RefDes; TYPE: TYPE
Z-SNT = BZT52C12-13-F:BZT52C12-13-F: Diodes Inc BZT52C12-13-F Zener Diode, 12V 5% 500 mW SMT 2-Pin SOD-123 Source: Datasheet <https://www.diodes.com//assets/Datasheets/ds18004.pdf>; DESCRIPTION: Diodes Inc BZT52C12-13-F Zener Diode, 12V 5% 500 mW SMT 2-Pin SOD-123; HEIGHT: 1.45mm; MANUFACTURER_NAME: Diodes Incorporated; MANUFACTURER_PART_NUMBER: BZT52C12-13-F; MOUSER_PART_NUMBER: 621-BZT52C12-13-F; MOUSER_PRICE-STOCK: https://www.mouser.co.uk/ProductDetail/Diodes-Incorporated/BZT52C12-13-F?qs=HTVp8UxD9pVKIHiLPWVR%2FQ%3D%3D